# EAGLE board ESP32 Display 4.3 inch V1.3 (EAGLE 9.6.2), part 1 of 2
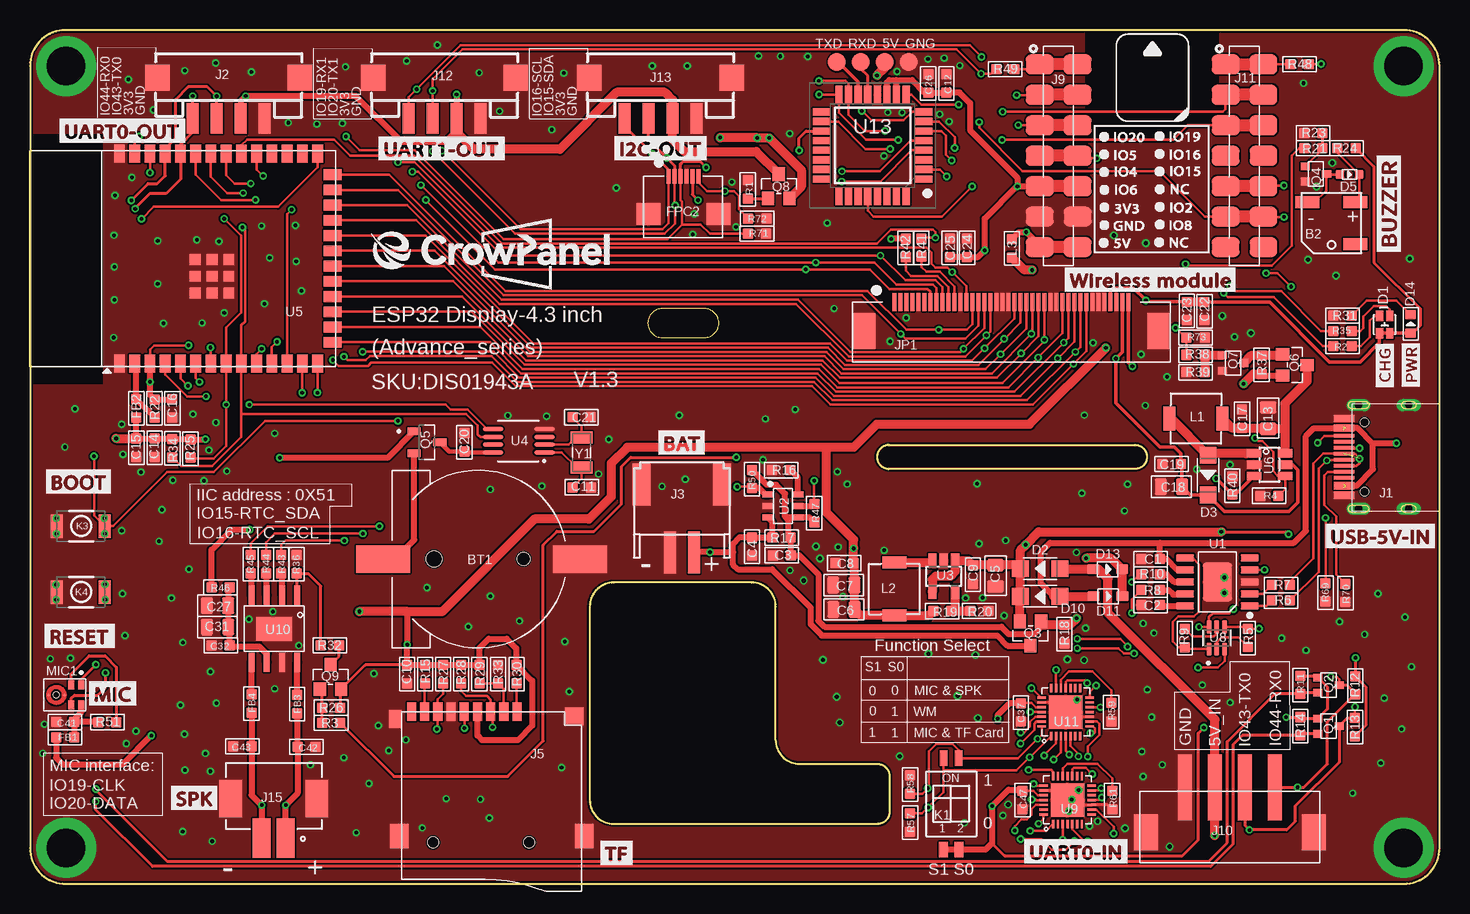
[diagram p2: board, top side]
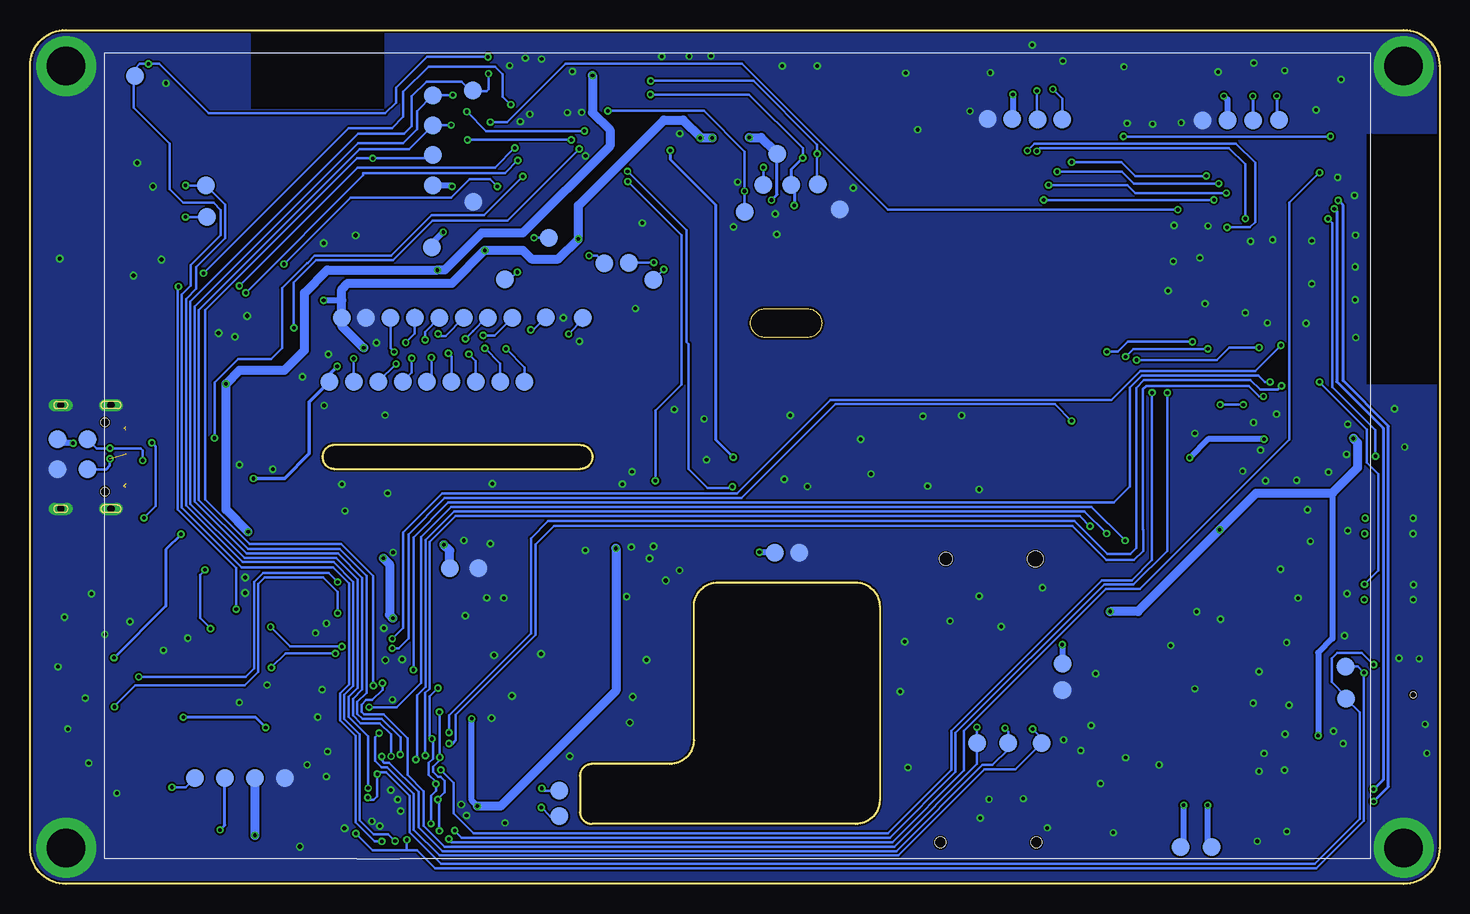
[diagram p3: board, bottom side, seen from below]

Size 117.5 x 71.2 mm. Coordinates in mm from the lower left corner, seen from the top.
Outline: 114.5,71.2 3,71.2 arc90 0,68.2 0,3 arc90 3,0 114.5,0 arc90 117.5,3 117.5,68.2 arc90 114.5,71.2
Outline: 70.62,35.6 arc90 71.62,34.6 92.12,34.6 arc90 93.12,35.6 arc90 92.12,36.6 71.62,36.6 arc90 70.62,35.6
Outline: 70.65,10 arc-90 71.65,9 71.65,6 arc-90 70.65,5 48.67,5 arc-90 46.67,7 46.67,23.13 arc-90 48.67,25.13 60.17,25.13 arc-90 62.17,23.13 62.17,12 arc90 64.17,10 70.65,10
Outline: 52.7,45.56 56.22,45.56 arc180 56.22,47.96 52.7,47.96 arc180 52.7,45.56
Copper layers (1*16): Top 0.035mm / dielectric 1.5mm / Bottom 0.035mm
Design rules "default *": minimum track width 8mil, minimum drill 0.3mm, track to track 6mil, track to pad 6mil, pad to pad 4mil, via to via 6mil, smd to smd 6mil, copper to edge 6mil, drill to drill 4mil, minimum pad ring 6mil, minimum via ring 6mil, stop-mask expansion 4mil, vias tented up to drill 100mil, thermal gap 0mil
tKeepout: area 54.3,22.9 to 63.2,29.9; area 0,41.7 to 6,62.4
tRestrict: area 88,64.6 to 99.1,71.2; area 0.1,41.7 to 6.1,62.5
bRestrict: area 88,64.6 to 99.1,71.2; area -0.1,41.7 to 6.1,62.5

## Footprints (pad centres in the part's own frame; a part is rotated, then mirrored left to right if it is on the bottom)
BEEP_5025 = smd 2 x 1: 1 -2,-1.75; 2 2,-1.75; 3 -2,1.75
CR1220 = smd 2.3 x 4.5: N 0,8.425; P 0,-7.975 | hole 1.3: 0,-3.725 | hole 1.05: 0,3.725
C0603 = smd 0.889 x 0.889: 1 -0.762,0; 2 0.762,0
C0805 = smd 1.016 x 1.397: 1 -0.889,0; 2 0.889,0
LED_KT-0603RYG = smd 0.85 x 0.6: 1 0.725,-0.425; 2 0.725,0.425; 3 -0.725,-0.425; 4 -0.725,0.425
D_SOD123FL = smd 1.397 x 1.397: + -1.651,0; - 1.651,0
D_SOD523 = smd 0.762 x 0.7: + -0.8,0; - 0.8,0
D_SOD323 = smd 1 x 0.8: + -1.2,0; - 1.2,0
LED0603 = smd 0.762 x 0.889: + -0.762,0; - 0.762,0
L0603 = smd 0.889 x 0.889: 1 -0.762,0; 2 0.762,0
CROWPANEL_ADVANCE_HMI_FPC-6PIN-0.5MM = smd 0.3 x 1.2: 1 -1.25,1.573; 2 -0.75,1.573; 3 -0.25,1.573; 4 0.25,1.573; 5 0.75,1.573; 6 1.25,1.573 | smd 2 x 1.8: 7 -2.9,-1.575; 8 2.9,-1.575
USB-3.0TYPEC-SMD = smd 0.3 x 1.7: A1 -3.35,0.5; A4 -2.55,0.5; A5 -1.25,0.5; A6 -0.25,0.5; A7 0.25,0.5; A8 1.25,0.5; A9 2.55,0.5; A12 3.35,0.5; B1 3.05,0.5; B4 2.25,0.5; B5 1.75,0.5; B6 0.75,0.5; B7 -0.75,0.5; B8 -1.75,0.5; B9 -2.25,0.5; B12 -3.05,0.5 | drill 0.6 pad 1.016 long: P$1 -4.325,-0.72; P$2 4.325,-0.72; P$3 -4.325,-4.9; P$4 4.325,-4.9 | hole 0.68: -2.89,-1.22; 2.89,-1.22
CONNECTOR_4P-SMD-2.0 = smd 0.965 x 2.54: 1 -3,0; 2 -1,0; 3 1,0; 4 3,0 | smd 2.032 x 2.184: SS1 -5.946,3.4; SS2 5.946,3.4
PH2.0WT-2PIN = smd 1 x 3.5: P$1 -1,0; P$2 1,0 | smd 1.5 x 3.5: P$3 -3.35,-5.7; P$4 3.35,-5.7
THO-M3.2*5MM-HOLE = drill 3.2 pad 5: P$1 0,0
9P-SMD-W/-RING = smd 1.524 x 0.762: 1 0,4.4; 2 0,3.3; 3 0,2.2; 4 0,1.1; 5 0,0; 6 0,-1.1; 7 0,-2.2; 8 0,-3.3; 9 0,-4.4 | smd 1.524 x 1.016: G1 0.6,-5.746 | smd 2.032 x 1.524: G2 10.373,-5.4; G3 10.373,10 | smd 1.524 x 1.524: G4 0.392,9.181 | hole 0.889: 10.9,-2.6; 10.9,5.4
H7-2.54-18.28X2.5X5MM = smd 1.65 x 2.3: 1 -7.62,-1.58; 1-1 -7.62,1.58; 2 -5.08,-1.58; 2-2 -5.08,1.58; 3 -2.54,-1.58; 3-3 -2.54,1.58; 4 0,-1.58; 4-4 0,1.58; 5 2.54,-1.58; 5-5 2.54,1.58; 6 5.08,-1.58; 6-6 5.08,1.58; 7 7.62,-1.58; 7-7 7.62,1.58
XH2.54-4P-SMD = smd 1.2 x 5.5: 1 -3.75,-1.875; 2 -1.25,-1.875; 3 1.25,-1.875; 4 3.75,-1.875 | smd 2 x 3: 5 -7,1.875; 6 7,1.875
TEST-PIN-4-2.0MM = smd 1.5 x 1.5: 1 -3,0; 2 -1,0; 3 1,0; 4 3,0
CONN-TH_2P-P2.00_XUNPU_WAFER-PH2.0-2PLB = smd 1.5 x 3.3: 1 -1,1.65; 2 1,1.65 | smd 1.9 x 3.1: 3 3.6,-1.65; 4 -3.6,-1.65
COOPER_0.5MM*40P = smd 0.3 x 1.5: P$1 -8.81,1.73; P$2 -8.31,1.73; P$3 -7.81,1.73; P$4 -7.31,1.73; P$5 -6.81,1.73; P$6 -6.31,1.73; P$7 -5.81,1.73; P$8 -5.31,1.73; P$9 -4.81,1.73; P$10 -4.31,1.73; P$11 -3.81,1.73; P$12 -3.31,1.73; P$13 -2.81,1.73; P$14 -2.31,1.73; P$15 -1.81,1.73; P$16 -1.31,1.73; P$17 -0.81,1.73; P$18 -0.31,1.73; P$19 0.19,1.73; P$20 0.69,1.73; P$21 1.19,1.73; P$22 1.69,1.73; P$23 2.19,1.73; P$24 2.69,1.73; P$25 3.19,1.73; P$26 3.69,1.73; P$27 4.19,1.73; P$28 4.69,1.73; P$29 5.19,1.73; P$30 5.69,1.73; P$31 6.19,1.73; P$32 6.69,1.73; P$33 7.19,1.73; P$34 7.69,1.73; P$35 8.19,1.73; P$36 8.69,1.73; P$37 9.19,1.73; P$38 9.69,1.73; P$39 10.19,1.73; P$40 10.69,1.73 | smd 1.8 x 3: P$41 -11.31,-0.67; P$42 13.19,-0.67
SW-SMD_DSHP02TS-S_1 = smd 0.76 x 1.27: 1 -0.635,-3.81; 2 0.635,-3.81 | smd 0.635 x 1.27: 3 0.635,3.81; 4 -0.635,3.81
157SW = smd 1.016 x 1.981: 1 0,0; 2 4,0
L0420 = smd 2 x 1: 1 0,2.2; 2 0,-2.2
MIC-SMD_5P-L3.5-W2.7-P1.67 = smd 0.725 x 0.522: 1 -0.838,1.362; 2 -0.838,0.542; 3 0.838,0.542; 4 0.838,1.362 | smd 0.25 x 0.25: 5_1 0,-0.048; 5_2 0,-1.373 | hole 0.5: 0,-0.71
TEST_PAD-1.5MM = smd 1.5 x 1.5: P$1 0,0
MOS_SOT323 = smd 0.635 x 0.762: 1 -0.635,-0.889; 2 0.635,-0.889; 3 0,0.889
PMOS_SOT23 = smd 1.016 x 1.143: 1 -0.889,-1.016; 2 0.889,-1.016; 3 0,1.016
SOT-23 = smd 1.09 x 0.61: 1 -1.07,0.915; 2 -1.07,-0.915; 3 1.07,0
R0603-SP = smd 0.889 x 0.889: 1 -0.762,0; 2 0.762,0
ESOP-10-EP-150MIL = smd 1.5 x 0.6: 1 -2.7,2; 2 -2.7,1; 3 -2.7,0; 4 -2.7,-1; 5 -2.7,-2; 6 2.7,-2; 7 2.7,-1; 8 2.7,0; 9 2.7,1; 10 2.7,2 | smd 2.4 x 3.2: EP 0,0
SOT23-6L = smd 0.5 x 0.9: 1 -0.961,-1.212; 2 -0.011,-1.212; 3 0.94,-1.212; 4 0.94,1.288; 5 -0.011,1.288; 6 -0.961,1.288
IC_SOT23-5 = smd 0.69 x 1.2: 1 -0.95,-1.3; 2 0,-1.3; 3 0.95,-1.3; 4 0.95,1.3; 5 -0.95,1.3
MSOP-8 = smd 0.364 x 1.692: 1 -0.975,-2.146; 2 -0.325,-2.146; 3 0.325,-2.146; 4 0.975,-2.146; 5 0.975,2.146; 6 0.325,2.146; 7 -0.325,2.146; 8 -0.975,2.146
ESP32-S3-WROOM-1-SMD41 = smd 1.5 x 0.9: 1 -8.75,5.26; 2 -8.75,3.99; 3 -8.75,2.72; 4 -8.75,1.45; 5 -8.75,0.18; 6 -8.75,-1.09; 7 -8.75,-2.36; 8 -8.75,-3.63; 9 -8.75,-4.9; 10 -8.75,-6.17; 11 -8.75,-7.44; 12 -8.75,-8.71; 13 -8.75,-9.98; 14 -8.75,-11.25; 27 8.75,-11.25; 28 8.75,-9.98; 29 8.75,-8.71; 30 8.75,-7.44; 31 8.75,-6.17; 32 8.75,-4.9; 33 8.75,-3.63; 34 8.75,-2.36; 35 8.75,-1.09; 36 8.75,0.18; 37 8.75,1.45; 38 8.75,2.72; 39 8.75,3.99; 40 8.75,5.26 | smd 0.9 x 1.5: 15 -6.985,-12.5; 16 -5.715,-12.5; 17 -4.445,-12.5; 18 -3.175,-12.5; 19 -1.905,-12.5; 20 -0.635,-12.5; 21 0.635,-12.5; 22 1.905,-12.5; 23 3.175,-12.5; 24 4.445,-12.5; 25 5.715,-12.5; 26 6.985,-12.5 | smd 0.9 x 0.9: 41 -2.9,-1.06; 42 -1.5,-1.06; 43 -0.1,-1.06; 44 -2.9,-2.46; 45 -1.5,-2.46; 46 -0.1,-2.46; 47 -2.9,-3.86; 48 -1.5,-3.86; 49 -0.1,-3.86
COOPER_SOT23-6 = smd 0.69 x 1.2: 1 -0.95,-1.3; 2 0,-1.3; 3 0.95,-1.3; 4 0.95,1.3; 5 0,1.3; 6 -0.95,1.3
SOP65P210X100-6N = smd 1.09 x 0.4: 1 -0.92,0.65; 2 -0.92,0; 3 -0.92,-0.65; 4 0.92,-0.65; 5 0.92,0; 6 0.92,0.65
QFN-28_L4.0-W4.0-P0.40-BL-EP2.8 = smd 0.2 x 0.7: 1 -1.2,-2; 2 -0.8,-2; 3 -0.4,-2; 4 0,-2; 5 0.4,-2; 6 0.8,-2; 7 1.2,-2; 15 1.2,2; 16 0.8,2; 17 0.4,2; 18 0,2; 19 -0.4,2; 20 -0.8,2; 21 -1.2,2 | smd 0.7 x 0.2: 8 2,-1.2; 9 2,-0.8; 10 2,-0.4; 11 2,0; 12 2,0.4; 13 2,0.8; 14 2,1.2; 22 -2,1.2; 23 -2,0.8; 24 -2,0.4; 25 -2,0; 26 -2,-0.4; 27 -2,-0.8; 28 -2,-1.2 | smd 2.8 x 2.8: 29 0,0
NS4168-ESOP-8 = smd 1.6 x 0.5: 1 -2.8,1.905; 2 -2.8,0.635; 3 -2.8,-0.635; 4 -2.8,-1.905; 5 2.8,-1.905; 6 2.8,-0.635; 7 2.8,0.635; 8 2.8,1.905 | smd 2 x 3: 9 0,0
QFP80P900X900X165-32N = smd 1.475 x 0.6: 1 -4.238,2.8; 2 -4.238,2; 3 -4.238,1.2; 4 -4.238,0.4; 5 -4.238,-0.4; 6 -4.238,-1.2; 7 -4.238,-2; 8 -4.238,-2.8; 17 4.238,-2.8; 18 4.238,-2; 19 4.238,-1.2; 20 4.238,-0.4; 21 4.238,0.4; 22 4.238,1.2; 23 4.238,2; 24 4.238,2.8 | smd 0.6 x 1.475: 9 -2.8,-4.238; 10 -2,-4.238; 11 -1.2,-4.238; 12 -0.4,-4.238; 13 0.4,-4.238; 14 1.2,-4.238; 15 2,-4.238; 16 2.8,-4.238; 25 2.8,4.238; 26 2,4.238; 27 1.2,4.238; 28 0.4,4.238; 29 -0.4,4.238; 30 -1.2,4.238; 31 -2,4.238; 32 -2.8,4.238
SMD3215-2P = smd 1 x 1.8: 1 -1.25,0; 2 1.25,0

## Placement (x,y rotation side)
B2  BEEP_5025  [BEEP_5025]  108.49,55.1 180 top
BT1  CR1220  [CR1220]  37.41,27.09 270 top
C1  1uF  [C0603]  93.42,27.08 0 top
C2  1uF  [C0603]  93.41,23.25 0 top
C3  1uF  [C0603]  62.68,27.4 0 top
C4  NC/10uF  [C0603]  60.2,28.13 90 top
C5  22uF  [C0805]  80.49,25.69 90 top
C6  22uF  [C0805]  67.86,22.89 0 top
C7  22uF  [C0805]  67.84,24.92 0 top
C8  1uF  [C0603]  67.89,26.75 0 top
C9  1uF  [C0603]  78.6,25.78 90 top
C10  1uF  [C0603]  31.44,17.49 90 top
C11  18pF  [C0603]  46,33.07 0 top
C12  10uF  [C0603]  76.4,66.74 270 top
C13  22uF  [C0805]  103.2,38.84 90 top
C14  10uF  [C0603]  10.4,36.36 90 top
C15  100nF  [C0603]  8.87,36.36 90 top
C16  1uF  [C0603]  11.87,39.65 90 top
C17  1uF  [C0603]  101.03,38.79 270 top
C18  22uF  [C0805]  95.15,33.11 180 top
C19  100nF  [C0603]  95.17,35.01 0 top
C20  1uF  [C0603]  36.22,36.83 90 top
C21  18pF  [C0603]  45.97,38.91 180 top
C22  4.7uF  [C0603]  97.92,47.75 90 top
C23  100nF  [C0603]  96.44,47.76 90 top
C24  10uF  [C0603]  78.12,53.03 270 top
C25  100nF  [C0603]  76.68,53.03 270 top
C26  100nF  [C0603]  74.88,66.75 270 top
C27  47uF  [C0805]  15.64,23.2 180 top
C31  47uF  [C0805]  15.64,21.42 180 top
C32  100nF  [C0603]  15.9,19.88 180 top
C37  1uF  [C0603]  82.6,14.3 90 top
C41  100nF  [C0603]  2.94,13.5 0 top
C42  1nF  [C0603]  23.06,11.42 180 top
C43  1nF  [C0603]  17.71,11.47 0 top
C47  1uF  [C0603]  82.75,6.99 270 top
D1  KT-0603RYG  [LED_KT-0603RYG]  112.92,46.64 270 top
D2  DSS34  [D_SOD123FL]  84.21,26.29 180 top
D3  DSS34  [D_SOD123FL]  98.21,34.08 270 top
D5  B5819WT  [D_SOD523]  110,59.15 0 top
D10  DSS34  [D_SOD123FL]  84.21,23.98 180 top
D11  1N5817WS  [D_SOD323]  89.86,23.99 0 top
D13  1N5817WS  [D_SOD323]  89.84,26.24 0 top
D14  Red  [LED0603]  115.09,46.7 90 top
FB1  0R/800mA  [L0603]  2.94,12.23 0 top
FB2  0R/800mA  [L0603]  8.87,39.66 90 top
FB3  1K/300mA  [L0603]  22.27,15 270 top
FB4  1K/300mA  [L0603]  18.47,15.03 270 top
FPC2  CROWPANEL_ADVANCE_HMI_FPC-6PIN-0.5MM  [CROWPANEL_ADVANCE_HMI_FPC-6PIN-0.5MM]  54.48,57.42 0 top
J1  TYPEC-3.0-16P-SMD  [USB-3.0TYPEC-SMD]  110.03,35.6 90 top
J2  HY2.0-4P-SMT  [CONNECTOR_4P-SMD-2.0]  16.57,63.83 0 top
J3  PH2.0WT-2PIN  [PH2.0WT-2PIN]  54.35,27.62 180 top
J4  THO-M3.25MM-HOLE  [THO-M3.2*5MM-HOLE]  114.5,3 0 top
J5  [9P-SMD-W/-RING]  36.2,14.36 270 top
J6  THO-M3.25MM-HOLE  [THO-M3.2*5MM-HOLE]  3,3 0 top
J7  THO-M3.25MM-HOLE  [THO-M3.2*5MM-HOLE]  114.5,68.2 0 top
J8  THO-M3.25MM-HOLE  [THO-M3.2*5MM-HOLE]  3,68.2 0 top
J9  [H7-2.54-18.28X2.5X5MM]  85.75,60.71 270 top
J10  XH2.54-4P-SMT  [XH2.54-4P-SMD]  100.02,6.18 180 top
J11  [H7-2.54-18.28X2.5X5MM]  101.24,60.71 270 top
J12  HY2.0-4P-SMT  [CONNECTOR_4P-SMD-2.0]  34.57,63.83 0 top
J13  HY2.0-4P-SMT  [CONNECTOR_4P-SMD-2.0]  52.57,63.83 0 top
J14  HC-PZ200-8.7L-1X4PZ1  [TEST-PIN-4-2.0MM]  70.27,68.52 0 top
J15  WAFER-PH2.0-2PLB  [CONN-TH_2P-P2.00_XUNPU_WAFER-PH2.0-2PLB]  20.32,5.46 180 top
JP1  COOPER_0.5MM-40PIN40PIN  [COOPER_0.5MM*40P]  80.87,46.76 0 top
K1  DSHP02TS-S  [SW-SMD_DSHP02TS-S_1]  76.79,6.68 0 top
K3  BUTTON  [157SW]  2.24,29.83 0 top
K4  BUTTON  [157SW]  2.24,24.33 0 top
L1  4.7uH/3A  [L0420]  97.2,38.81 270 top
L2  4.7uH/3A  [L0420]  72.04,24.59 0 top
L3  NC  [L0603]  81.85,53 270 top
MIC1  LMD3526B261-OFA01  [MIC-SMD_5P-L3.5-W2.7-P1.67]  2.91,15.76 270 top
P1  TEST_PADPAD-1.5MM  [TEST_PAD-1.5MM]  115.19,37.07 0 bottom
P2  TEST_PADPAD-1.5MM  [TEST_PAD-1.5MM]  112.69,37.07 0 bottom
P3  TEST_PADPAD-1.5MM  [TEST_PAD-1.5MM]  112.69,34.57 0 bottom
P4  TEST_PADPAD-1.5MM  [TEST_PAD-1.5MM]  115.19,34.57 0 bottom
P5  TEST_PADPAD-1.5MM  [TEST_PAD-1.5MM]  102.74,55.62 180 bottom
P6  TEST_PADPAD-1.5MM  [TEST_PAD-1.5MM]  33.15,11.75 0 bottom
P7  TEST_PADPAD-1.5MM  [TEST_PAD-1.5MM]  35.94,11.76 0 bottom
P8  TEST_PADPAD-1.5MM  [TEST_PAD-1.5MM]  38.55,11.74 0 bottom
P9  TEST_PADPAD-1.5MM  [TEST_PAD-1.5MM]  55.4,27.6 180 bottom
P10  TEST_PADPAD-1.5MM  [TEST_PAD-1.5MM]  53.37,27.63 180 bottom
P11  TEST_PADPAD-1.5MM  [TEST_PAD-1.5MM]  82.52,26.31 0 bottom
P12  TEST_PADPAD-1.5MM  [TEST_PAD-1.5MM]  80.12,26.33 0 bottom
P13  TEST_PADPAD-1.5MM  [TEST_PAD-1.5MM]  31.43,18.35 0 bottom
P14  TEST_PADPAD-1.5MM  [TEST_PAD-1.5MM]  102.84,58.24 180 bottom
P15  TEST_PADPAD-1.5MM  [TEST_PAD-1.5MM]  19.76,63.65 0 bottom
P16  TEST_PADPAD-1.5MM  [TEST_PAD-1.5MM]  7.81,15.45 0 bottom
P17  TEST_PADPAD-1.5MM  [TEST_PAD-1.5MM]  98.77,8.83 0 bottom
P18  TEST_PADPAD-1.5MM  [TEST_PAD-1.5MM]  96.27,8.83 0 bottom
P19  TEST_PADPAD-1.5MM  [TEST_PAD-1.5MM]  101.27,8.83 0 bottom
P20  TEST_PADPAD-1.5MM  [TEST_PAD-1.5MM]  103.77,8.83 0 bottom
P21  TEST_PADPAD-1.5MM  [TEST_PAD-1.5MM]  83.93,65.74 0 bottom
P22  TEST_PADPAD-1.5MM  [TEST_PAD-1.5MM]  83.93,63.22 0 bottom
P23  TEST_PADPAD-1.5MM  [TEST_PAD-1.5MM]  83.93,60.76 0 bottom
P25  TEST_PADPAD-1.5MM  [TEST_PAD-1.5MM]  21.6,3.06 0 bottom
P26  TEST_PADPAD-1.5MM  [TEST_PAD-1.5MM]  18.99,3.06 0 bottom
P27  TEST_PADPAD-1.5MM  [TEST_PAD-1.5MM]  7.84,18.12 0 bottom
P28  TEST_PADPAD-1.5MM  [TEST_PAD-1.5MM]  31.44,16.14 0 bottom
P31  TEST_PADPAD-1.5MM  [TEST_PAD-1.5MM]  17.68,63.68 0 bottom
P32  TEST_PADPAD-1.5MM  [TEST_PAD-1.5MM]  35.62,63.78 0 bottom
P33  TEST_PADPAD-1.5MM  [TEST_PAD-1.5MM]  15.53,63.68 0 bottom
P34  TEST_PADPAD-1.5MM  [TEST_PAD-1.5MM]  13.38,63.7 0 bottom
P35  TEST_PADPAD-1.5MM  [TEST_PAD-1.5MM]  31.45,63.74 0 bottom
P36  TEST_PADPAD-1.5MM  [TEST_PAD-1.5MM]  33.48,63.74 0 bottom
P37  TEST_PADPAD-1.5MM  [TEST_PAD-1.5MM]  37.67,63.79 0 bottom
P38  TEST_PADPAD-1.5MM  [TEST_PAD-1.5MM]  55.21,60.88 0 bottom
P39  TEST_PADPAD-1.5MM  [TEST_PAD-1.5MM]  54.04,58.28 0 bottom
P40  TEST_PADPAD-1.5MM  [TEST_PAD-1.5MM]  51.83,58.33 0 bottom
P41  TEST_PADPAD-1.5MM  [TEST_PAD-1.5MM]  50.02,56.25 0 bottom
P42  TEST_PADPAD-1.5MM  [TEST_PAD-1.5MM]  73.39,7.77 270 bottom
P43  TEST_PADPAD-1.5MM  [TEST_PAD-1.5MM]  73.37,5.66 270 bottom
P44  TEST_PADPAD-1.5MM  [TEST_PAD-1.5MM]  91.51,47.2 0 bottom
P45  TEST_PADPAD-1.5MM  [TEST_PAD-1.5MM]  89.48,47.2 0 bottom
P46  TEST_PADPAD-1.5MM  [TEST_PAD-1.5MM]  92.53,41.87 0 bottom
P47  TEST_PADPAD-1.5MM  [TEST_PAD-1.5MM]  90.5,41.87 0 bottom
P48  TEST_PADPAD-1.5MM  [TEST_PAD-1.5MM]  88.47,41.87 0 bottom
P49  TEST_PADPAD-1.5MM  [TEST_PAD-1.5MM]  87.45,47.2 0 bottom
P50  TEST_PADPAD-1.5MM  [TEST_PAD-1.5MM]  86.43,41.87 0 bottom
P51  TEST_PADPAD-1.5MM  [TEST_PAD-1.5MM]  85.42,47.2 0 bottom
P52  TEST_PADPAD-1.5MM  [TEST_PAD-1.5MM]  84.4,41.87 0 bottom
P53  TEST_PADPAD-1.5MM  [TEST_PAD-1.5MM]  83.39,47.2 0 bottom
P54  TEST_PADPAD-1.5MM  [TEST_PAD-1.5MM]  82.37,41.87 0 bottom
P55  TEST_PADPAD-1.5MM  [TEST_PAD-1.5MM]  81.35,47.2 0 bottom
P56  TEST_PADPAD-1.5MM  [TEST_PAD-1.5MM]  80.34,41.87 0 bottom
P57  TEST_PADPAD-1.5MM  [TEST_PAD-1.5MM]  79.32,47.2 0 bottom
P58  TEST_PADPAD-1.5MM  [TEST_PAD-1.5MM]  108.74,67.35 0 bottom
P59  TEST_PADPAD-1.5MM  [TEST_PAD-1.5MM]  80.6,66.18 0 bottom
P60  TEST_PADPAD-1.5MM  [TEST_PAD-1.5MM]  80.55,56.86 0 bottom
P61  TEST_PADPAD-1.5MM  [TEST_PAD-1.5MM]  83.9,58.26 0 bottom
P62  TEST_PADPAD-1.5MM  [TEST_PAD-1.5MM]  83.98,53.08 0 bottom
P63  TEST_PADPAD-1.5MM  [TEST_PAD-1.5MM]  78.31,41.87 0 bottom
P64  TEST_PADPAD-1.5MM  [TEST_PAD-1.5MM]  77.29,47.2 0 bottom
P65  TEST_PADPAD-1.5MM  [TEST_PAD-1.5MM]  76.27,41.87 0 bottom
P66  TEST_PADPAD-1.5MM  [TEST_PAD-1.5MM]  71.42,47.18 0 bottom
P67  TEST_PADPAD-1.5MM  [TEST_PAD-1.5MM]  74.51,47.23 0 bottom
P68  TEST_PADPAD-1.5MM  [TEST_PAD-1.5MM]  77.9,50.39 0 bottom
P69  TEST_PADPAD-1.5MM  [TEST_PAD-1.5MM]  74.26,53.88 0 bottom
P70  TEST_PADPAD-1.5MM  [TEST_PAD-1.5MM]  69.61,51.76 0 bottom
P71  TEST_PADPAD-1.5MM  [TEST_PAD-1.5MM]  67.58,51.78 0 bottom
P72  TEST_PADPAD-1.5MM  [TEST_PAD-1.5MM]  65.54,50.35 0 bottom
P75  TEST_PADPAD-1.5MM  [TEST_PAD-1.5MM]  56.36,58.26 0 bottom
P76  TEST_PADPAD-1.5MM  [TEST_PAD-1.5MM]  57.93,56.02 0 bottom
Q1  BSS138W_SOT323  [MOS_SOT323]  108.24,13.15 270 top
Q2  BSS138W_SOT323  [MOS_SOT323]  108.24,16.58 270 top
Q3  AO3401  [PMOS_SOT23]  83.41,20.88 180 top
Q4  SS8050W-SOT323  [MOS_SOT323]  107.19,59.19 270 top
Q5  BAT54C-7-F  [SOT-23]  33.09,36.83 0 top
Q6  AO3401  [PMOS_SOT23]  105.44,43.27 270 top
Q7  SS8050W-SOT323  [MOS_SOT323]  100.29,43.43 270 top
Q8  AO3401  [PMOS_SOT23]  62.42,58.17 0 top
Q9  AO3401  [PMOS_SOT23]  25.06,17.26 0 top
R1  10K  [R0603-SP]  59.83,57.92 270 top
R2  2K  [R0603-SP]  109.41,44.84 180 top
R3  100R  [R0603-SP]  25.11,13.43 180 top
R4  10K  [R0603-SP]  103.31,32.36 0 top
R5  10K  [R0603-SP]  101.52,20.51 90 top
R6  0R  [R0603-SP]  104.28,23.62 0 top
R7  0R  [R0603-SP]  104.28,24.91 0 top
R8  0R  [R0603-SP]  93.42,24.51 0 top
R9  10K  [R0603-SP]  96.26,20.48 270 top
R10  0R  [R0603-SP]  93.41,25.81 0 top
R11  4.7K  [R0603-SP]  105.91,16.59 270 top
R12  4.7K  [R0603-SP]  110.47,16.55 270 top
R13  4.7K  [R0603-SP]  110.45,13.07 90 top
R14  4.7K  [R0603-SP]  105.91,13.15 270 top
R15  10K  [R0603-SP]  32.94,17.49 90 top
R16  2K  [R0603-SP]  62.62,34.5 0 top
R17  5.1K  [R0603-SP]  62.65,28.88 0 top
R18  10K  [R0603-SP]  86.23,20.81 90 top
R19  45.3K  [R0603-SP]  76.05,22.75 180 top
R20  10K  [R0603-SP]  79.14,22.75 180 top
R21  1K  [R0603-SP]  106.97,61.34 180 top
R22  10K  [R0603-SP]  10.38,39.64 90 top
R23  47K  [R0603-SP]  106.97,62.61 180 top
R24  3.9R  [R0603-SP]  109.76,61.34 0 top
R25  4.7K  [R0603-SP]  13.38,36.3 90 top
R26  10K  [R0603-SP]  25.11,14.69 180 top
R27  10K  [R0603-SP]  34.44,17.49 90 top
R28  10K  [R0603-SP]  35.94,17.49 90 top
R29  10K/NC  [R0603-SP]  37.46,17.49 90 top
R30  10K  [R0603-SP]  40.56,17.49 90 top
R31  5.1K  [R0603-SP]  109.42,47.38 0 top
R32  1K  [R0603-SP]  25,19.88 180 top
R33  10K  [R0603-SP]  39.01,17.49 90 top
R34  4.7K  [R0603-SP]  11.87,36.31 90 top
R35  5.1K  [R0603-SP]  109.41,46.12 180 top
R36  100K  [R0603-SP]  22.23,26.66 90 top
R37  100K  [R0603-SP]  102.67,43.28 270 top
R38  100R  [R0603-SP]  97.17,44.12 180 top
R39  10K  [R0603-SP]  97.17,42.67 180 top
R40  5.1R  [R0603-SP]  100.22,33.21 270 top
R41  0R  [R0603-SP]  74.3,53.05 90 top
R42  10K  [R0603-SP]  73,53.03 90 top
R43  0R  [R0603-SP]  20.95,26.65 90 top
R44  0R  [R0603-SP]  19.67,26.66 90 top
R45  0R  [R0603-SP]  18.39,26.66 90 top
R46  0R  [R0603-SP]  15.89,24.72 180 top
R47  5.1K  [R0603-SP]  65.38,30.92 270 top
R48  0R  [R0603-SP]  105.83,68.35 0 top
R49  0R  [R0603-SP]  81.3,67.93 180 top
R50  5.1K  [R0603-SP]  60.19,33.76 90 top
R51  10K/NC  [R0603-SP]  6.45,13.49 180 top
R57  10K  [R0603-SP]  73.37,5.11 270 top
R58  10K  [R0603-SP]  73.37,8.29 90 top
R59  10K  [R0603-SP]  90.13,14.33 270 top
R61  10K  [R0603-SP]  90.21,6.99 270 top
R69  5.1K  [R0603-SP]  108,24.3 90 top
R70  5.1K  [R0603-SP]  109.67,24.26 270 top
R71  5.1K  [R0603-SP]  60.61,54.21 180 top
R72  5.1K  [R0603-SP]  60.63,55.47 180 top
R73  10K/NC  [R0603-SP]  97.18,45.56 180 top
U1  CH340K  [ESOP-10-EP-150MIL]  98.98,25.18 180 top
U2  TP4059-SOT23-6  [SOT23-6L]  62.72,31.5 270 top
U3  RY3420  [IC_SOT23-5]  76.17,25.65 180 top
U4  PCF8563MDTR(XBLW)  [MSOP-8]  40.74,36.96 90 top
U5  ESP32-S3-WROOM-1  [ESP32-S3-WROOM-1-SMD41]  12.72,52.15 90 top
U6  MT9201  [COOPER_SOT23-6]  103.33,34.96 270 top
U8  UMH3NTN  [SOP65P210X100-6N]  98.93,20.51 90 top
U9  CH486F  [QFN-28_L4.0-W4.0-P0.40-BL-EP2.8]  86.49,6.99 0 top
U10  NS4168-ESOP-8  [NS4168-ESOP-8]  20.37,21.27 270 top
U11  CH486F  [QFN-28_L4.0-W4.0-P0.40-BL-EP2.8]  86.34,14.33 0 top
U13  STC8H1K28-36I-LQFP32  [QFP80P900X900X165-32N]  70.24,61.57 180 top
Y1  32.768KHZ  [SMD3215-2P]  45.98,35.97 90 top